# Altium schematic sheet Display.SchDoc
size A4
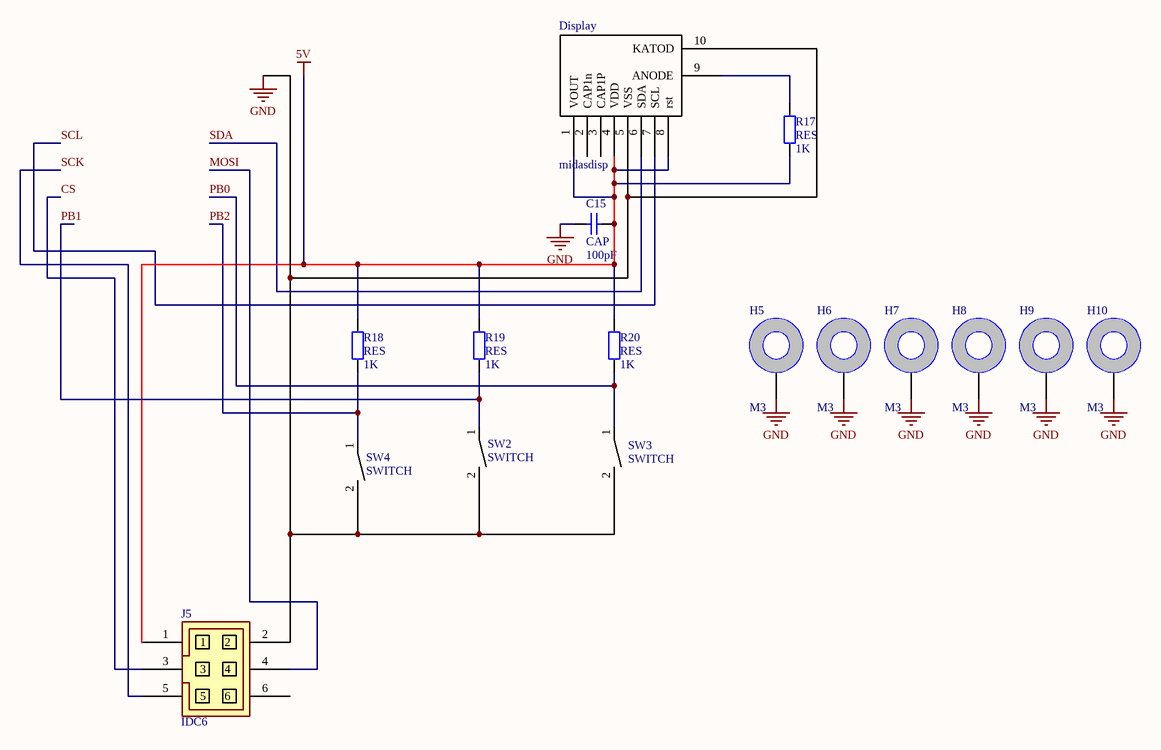
[diagram p0: Display.SchDoc]

## Parts
C15  CAP  value 100pF  [CAPC1608X08M]
Display  midasdisp  [Display]
H5  M3  [MOUNT_M3]
H6  M3  [MOUNT_M3]
H7  M3  [MOUNT_M3]
H8  M3  [MOUNT_M3]
H9  M3  [MOUNT_M3]
H10  M3  [MOUNT_M3]
J5  IDC6  [IDC6]
R17  RES  value 1K  [RESC1608X06M]
R18  RES  value 1K  [RESC1608X06M]
R19  RES  value 1K  [RESC1608X06M]
R20  RES  value 1K  [RESC1608X06M]
SW2  SWITCH  [Switch_pad]
SW3  SWITCH  [Switch_pad]
SW4  SWITCH  [Switch_pad]

## Nets
5V: C15.2 Display.1(VOUT) Display.4(VDD) Display.8(rst) J5.1 R17.1 R18.2 R19.2 R20.2
GND: C15.1 Display.5(VSS) Display.10(KATOD) H5.1 H6.1 H7.1 H8.1 H9.1 H10.1 J5.2 SW2.2 SW3.2 SW4.2
CS: J5.3
MOSI: J5.4
PB0: R20.1 SW3.1
PB1: R19.1 SW2.1
PB2: R18.1 SW4.1
SCK: J5.5
SCL: Display.7(SCL)
SDA: Display.6(SDA)
NetDisplay_9: Display.9(ANODE) R17.2

Not connected (* = marked no-connect by the designer): Display 2(CAP1n) 3(CAP1P); J5 6

## Library data of the parts
C15 = CAP: Capacitor; Published: 8-Jun-2000; LatestRevisionDate: 17-Jul-2002; LatestRevisionNote: Re-released for DXP Platform.; PackageReference: RB7.6-15; Publisher: Altium Limited; PackageDescription: Polarized Capacitor (Radial); 2 Leads
H5-H10 = MOUNT_M3
J5 = IDC6: 6pin IDC connector
R17-R20 = RES: Resistor; Published: 8-Jun-2000; LatestRevisionDate: 17-Jul-2002; LatestRevisionNote: Re-released for DXP Platform.; PackageReference: AXIAL-0.4; Publisher: Altium Limited; PackageDescription: Axial Device, Thru-Hole; 2 Leads; 0.4 in Pin Spacing